# EAGLE design 7segement4digits1badidea-many-digits-mk-1.1 (EAGLE 6.5.0)
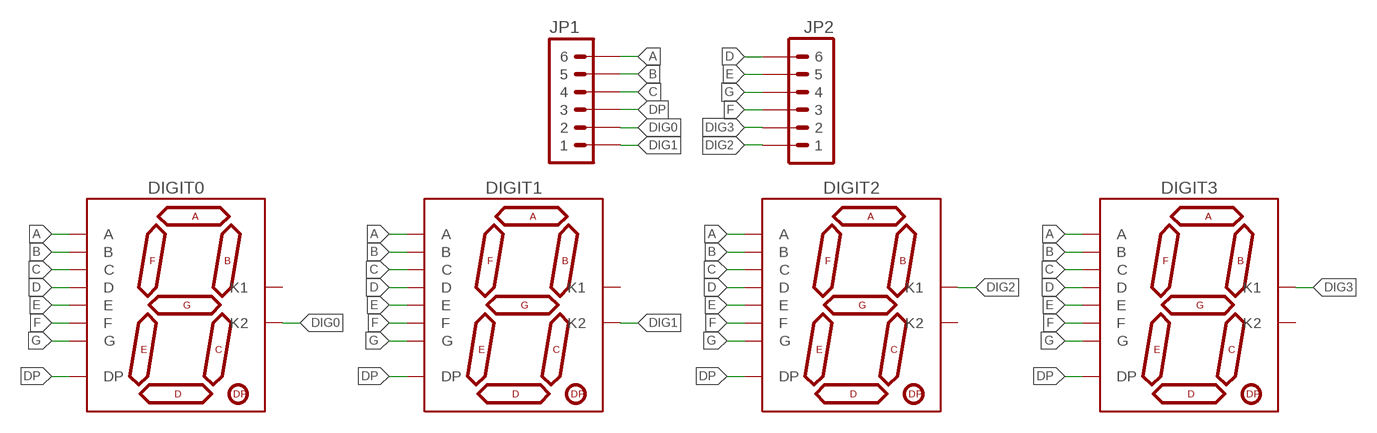
[diagram p0: schematic, sheet 1]

## Parts
DIGIT0  7SEG_1DIGPTH-10MM  [7SEG_1DIG_10MM]
DIGIT1  7SEG_1DIGPTH-10MM  [7SEG_1DIG_10MM]
DIGIT2  7SEG_1DIGPTH-10MM  [7SEG_1DIG_10MM]
DIGIT3  7SEG_1DIGPTH-10MM  [7SEG_1DIG_10MM]
JP1  M06-NOBS-PTH  [1X06_NOLOCK_FUCKITALL]
JP2  M06-NOBS-PTH  [1X06_NOLOCK_FUCKITALL]

## Nets
A: DIGIT0.10(A) DIGIT1.10(A) DIGIT2.10(A) DIGIT3.10(A) JP1.6
B: DIGIT0.9(B) DIGIT1.9(B) DIGIT2.9(B) DIGIT3.9(B) JP1.5
C: DIGIT0.8(C) DIGIT1.8(C) DIGIT2.8(C) DIGIT3.8(C) JP1.4
D: DIGIT0.5(D) DIGIT1.5(D) DIGIT2.5(D) DIGIT3.5(D) JP2.6
DIG0: DIGIT0.6(K2) JP1.2
DIG1: DIGIT1.6(K2) JP1.1
DIG2: DIGIT2.1(K1) JP2.1
DIG3: DIGIT3.1(K1) JP2.2
DP: DIGIT0.7(DP) DIGIT1.7(DP) DIGIT2.7(DP) DIGIT3.7(DP) JP1.3
E: DIGIT0.4(E) DIGIT1.4(E) DIGIT2.4(E) DIGIT3.4(E) JP2.5
F: DIGIT0.2(F) DIGIT1.2(F) DIGIT2.2(F) DIGIT3.2(F) JP2.3
G: DIGIT0.3(G) DIGIT1.3(G) DIGIT2.3(G) DIGIT3.3(G) JP2.4
Unconnected: DIGIT0.1(K1) DIGIT1.1(K1) DIGIT2.6(K2) DIGIT3.6(K2)

## Library data of the parts
DIGIT0 DIGIT1-DIGIT3 = A_butts:7SEG_1DIG
JP1 JP2 = A_butts:M06: Header 6 Standard 6-pin 0.1" header. Use with straight break away headers (SKU : PRT-00116), right angle break away headers (PRT-00553), swiss pins (PRT-00743), machine pins (PRT-00117), and female headers (PRT-00115). Molex polarized connector foot print use with SKU : PRT-08094 with associated crimp pins and housings. NOTES ON THE VARIANTS LOCK and LOCK_LONGPADS... This footprint was designed to help hold the alignment of a through-hole component (i.e. 6-pin header) while soldering it into place. You may notice that each hole has been shifted either up or down by 0.005 of an inch from it's more standard position (which is a perfectly straight line). This slight alteration caused the pins (the squares in the middle) to touch the edges of the holes. Because they are alternating, it causes a "brace" to hold the component in place. 0.005 has proven to be the perfect amount of "off-center" position when using our standard breakaway headers. Although looks a little odd when you look at the bare footprint, once you have a header in there, the alteration is very hard to notice. Also,if you push a header all the way into place, it is covered up entirely on the bottom side. This idea of altering the position of holes to aid alignment will be further integrated into the Sparkfun Library for other footprints. It can help hold any component with 3 or more connection pins.

## Board
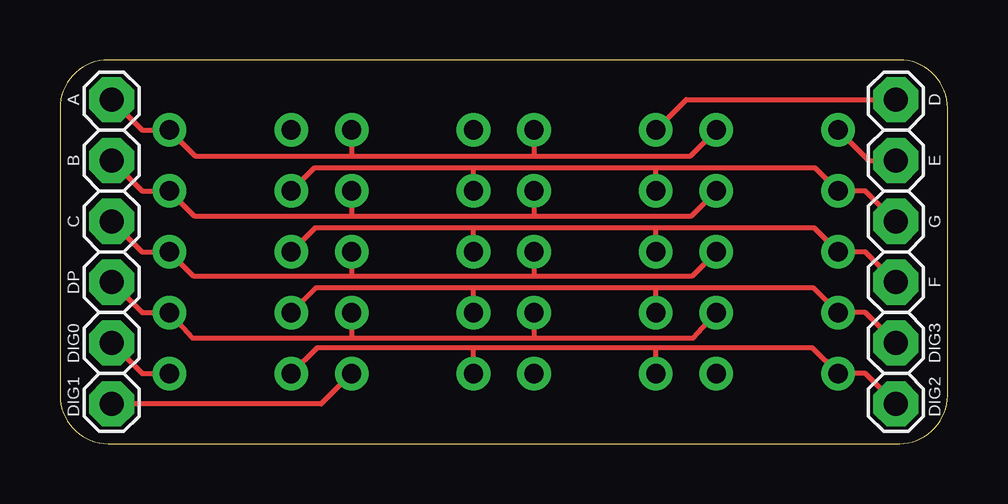
[diagram p1: board, top side]
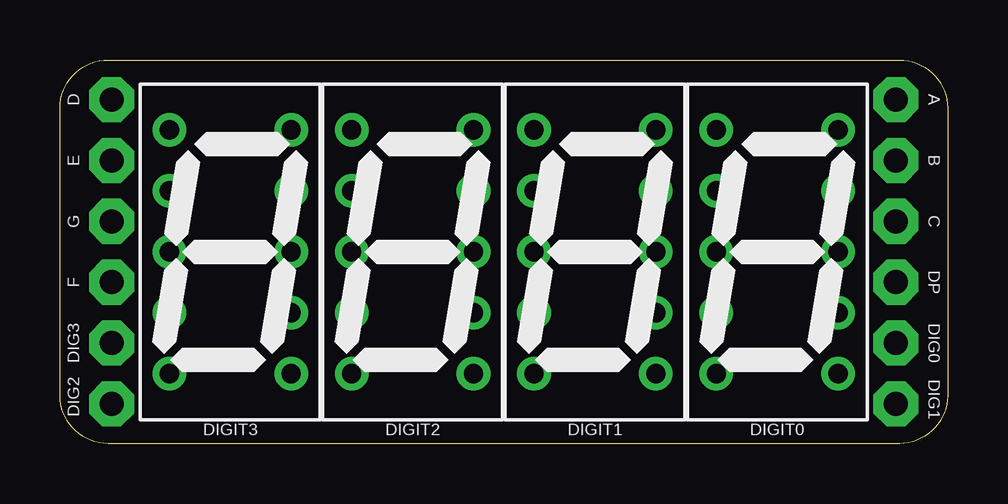
[diagram p2: board, bottom side, seen from below]

Size 37 x 16 mm. Coordinates in mm from the lower left corner, seen from the top.
Outline: 0,14 0,2 arc90 2,0 35,0 arc90 37,2 37,14 arc90 35,16 2,16 arc90 0,14
Copper layers (1*16): Top 0.0356mm / dielectric 1.5011mm / Bottom 0.0356mm
Design rules "LaenPCBOrder_2": minimum track width 6mil, minimum drill 13mil, track to track 6mil, track to pad 6mil, pad to pad 6mil, via to via 6mil, smd to smd 6mil, copper to edge 15mil, drill to drill 6mil, minimum pad ring 7mil, minimum via ring 7mil, stop-mask expansion 3mil, vias tented up to drill 20mil, thermal gap 10mil

### Footprints (pad centres in the part's own frame; a part is rotated, then mirrored left to right if it is on the bottom)
7SEG_1DIG_10MM = drill 0.8 pad 1.4: 1 -2.54,5.08; 2 -2.54,2.54; 3 -2.54,0; 4 -2.54,-2.54; 5 -2.54,-5.08; 6 2.54,-5.08; 7 2.54,-2.54; 8 2.54,0; 9 2.54,2.54; 10 2.54,5.08
1X06_NOLOCK_FUCKITALL = drill 1 pad 1.88 octagon: 1 0,0; 2 2.54,0; 3 5.08,0; 4 7.62,0; 5 10.16,0; 6 12.7,0

### Placement (x,y rotation side)
DIGIT0  7.1,8 0 bottom
DIGIT1  14.7,8 0 bottom
DIGIT2  22.3,8 0 bottom
DIGIT3  29.9,8 0 bottom
JP1  2.15,1.65 90 top
JP2  34.85,14.35 270 top

### Tracks (layer width: path | path; a pad name or v marks a point on that pad's centre or on a via)
A
  Top 0.2: JP1.6 3.42,13.08 DIGIT0.10 5.64,12 12.16,12 | 12.16,12 19.76,12 | 19.76,12 26.28,12 DIGIT3.10 | DIGIT1.10 12.16,12 | DIGIT2.10 19.76,12
B
  Top 0.2: JP1.5 3.42,10.54 DIGIT0.9 5.6,9.5 12.16,9.5 | 12.16,9.5 19.76,9.5 | 19.76,9.5 26.32,9.5 DIGIT3.9 | DIGIT1.9 12.16,9.5 | DIGIT2.9 19.76,9.5
C
  Top 0.2: JP1.4 3.42,8 DIGIT0.8 5.56,7 12.16,7 | 12.16,7 19.76,7 | 19.76,7 26.36,7 DIGIT3.8 | DIGIT1.8 12.16,7 | DIGIT2.8 19.76,7
D
  Top 0.2: JP2.6 33.58,2.92 DIGIT3.5 31.36,4 24.84,4 | 24.84,4 17.24,4 | 17.24,4 10.72,4 DIGIT0.5 | DIGIT2.5 24.84,4 | DIGIT1.5 17.24,4
DIG0
  Top 0.2: JP1.2 3.42,2.92 DIGIT0.6
DIG1
  Top 0.2: DIGIT1.6 10.89,1.65 JP1.1
DIG2
  Top 0.2: DIGIT2.1 26.11,14.35 JP2.1
DIG3
  Top 0.2: DIGIT3.1 33.71,11.81 JP2.2
DP
  Top 0.2: JP1.3 3.42,5.46 DIGIT0.7 5.52,4.4 12.16,4.4 | 12.16,4.4 19.76,4.4 | 19.76,4.4 26.4,4.4 DIGIT3.7 | DIGIT2.7 19.76,4.4 | DIGIT1.7 12.16,4.4
E
  Top 0.2: JP2.5 33.58,5.46 DIGIT3.4 31.4,6.5 24.84,6.5 | 24.84,6.5 17.24,6.5 | 17.24,6.5 10.68,6.5 DIGIT0.4 | DIGIT1.4 17.24,6.5 | DIGIT2.4 24.84,6.5
F
  Top 0.2: JP2.3 33.58,10.54 DIGIT3.2 31.48,11.5 24.84,11.5 | 24.84,11.5 17.24,11.5 | 17.24,11.5 10.6,11.5 DIGIT0.2 | DIGIT1.2 17.24,11.5 | DIGIT2.2 24.84,11.5
G
  Top 0.2: JP2.4 33.58,8 DIGIT3.3 31.44,9 24.84,9 | 24.84,9 17.24,9 | 17.24,9 10.64,9 DIGIT0.3 | DIGIT2.3 24.84,9 | DIGIT1.3 17.24,9

### Text on the board
tPlace: A | D | B | E | C | G | DP | F | DIG0 | DIG3 | DIG1 | DIG2
bPlace: A | D | B | E | C | G | DP | F | DIG0 | DIG3 | DIG1 | DIG2